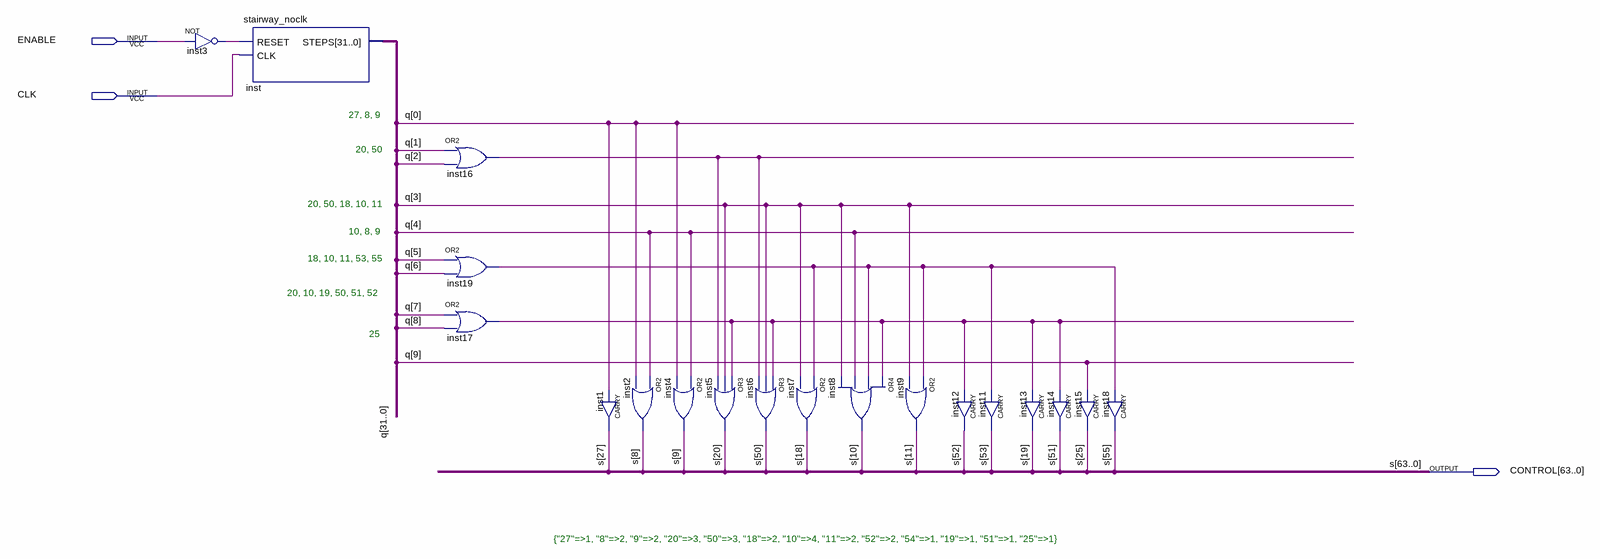
[diagram p0: schematic sheet]
// Quartus schematic macro_pop.bdf as structural Verilog: 19 symbols, 3 pins
module macro_pop (
  input  ENABLE,
  input  CLK,
  output [63:0] CONTROL
);

  wire inst3_out, inst16_out, inst17_out, inst19_out;
  wire [31:0] q;

  not inst3 (inst3_out, ENABLE);
  stairway_noclk inst (.RESET(inst3_out), .CLK(CLK), .STEPS(q));
  or inst16 (inst16_out, q[1], q[2]);
  or inst19 (inst19_out, q[5], q[6]);
  or inst17 (inst17_out, q[7], q[8]);
  or inst2 (CONTROL[8], q[4], q[0]);
  CARRY inst1 (.IN(q[0]), .OUT(CONTROL[27]));
  or inst4 (CONTROL[9], q[4], q[0]);
  or inst5 (CONTROL[20], inst17_out, q[3], inst16_out);
  or inst6 (CONTROL[50], inst17_out, q[3], inst16_out);
  or inst7 (CONTROL[18], inst19_out, q[3]);
  or inst8 (CONTROL[10], inst17_out, inst19_out, q[4], q[3]);
  or inst9 (CONTROL[11], inst19_out, q[3]);
  CARRY inst12 (.IN(inst17_out), .OUT(CONTROL[52]));
  CARRY inst11 (.IN(inst19_out), .OUT(CONTROL[53]));
  CARRY inst13 (.IN(inst17_out), .OUT(CONTROL[19]));
  CARRY inst14 (.IN(inst17_out), .OUT(CONTROL[51]));
  CARRY inst15 (.IN(q[9]), .OUT(CONTROL[25]));
  CARRY inst18 (.IN(inst19_out), .OUT(CONTROL[55]));

  // Other names for the same wires on the sheet: s[63:0] = CONTROL

  // Notes on the sheet:
  //   27, 8, 9
  //   20, 50
  //   20, 50, 18, 10, 11
  //   10, 8, 9
  //   18, 10, 11, 53, 55
  //   20, 10, 19, 50, 51, 52
  //   25
  //   {"27"=>1, "8"=>2, "9"=>2, "20"=>3, "50"=>3, "18"=>2, "10"=>4, "11"=>2, "52"=>2, "54"=>1, "19"=>1, "51"=>1, "25"=>1}
endmodule
